# EAGLE design remote (EAGLE 7.2.0)
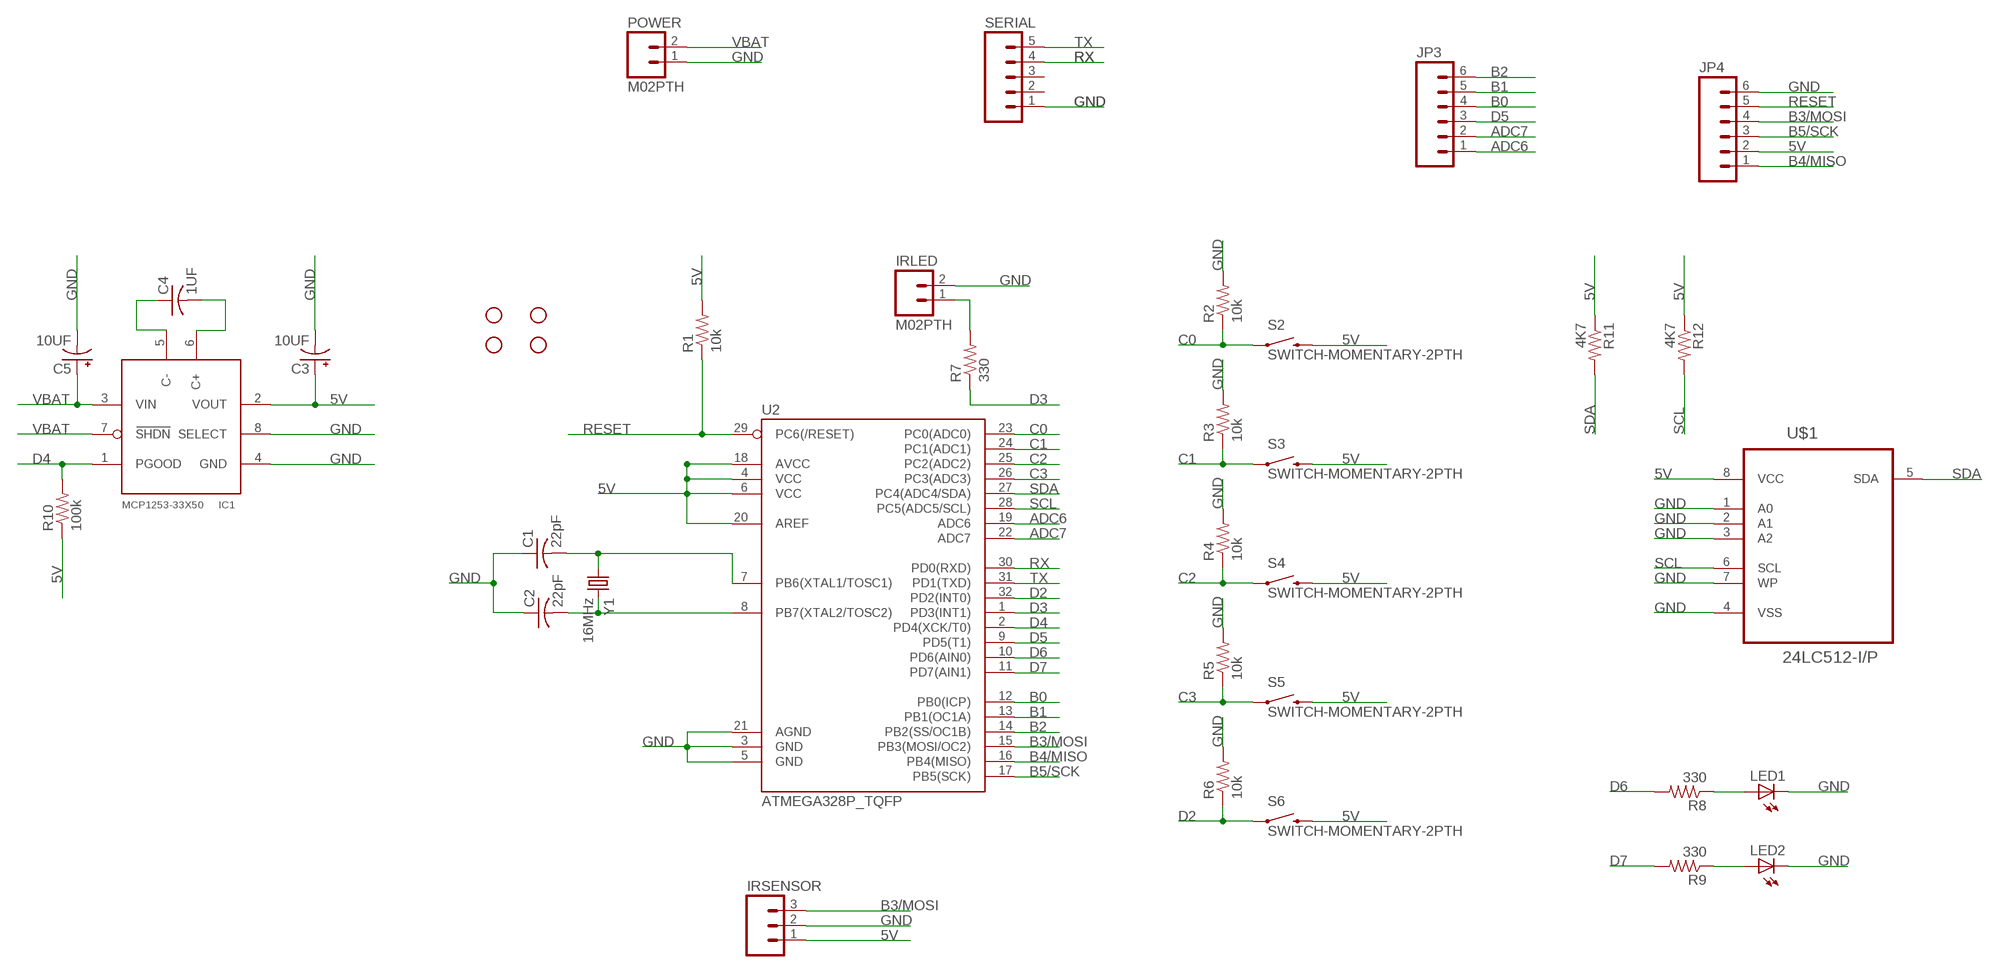
[diagram p0: schematic, sheet 1]

## Parts
C1  22pF  C-USC0805  [C0805]
C2  22pF  C-USC0805  [C0805]
C3  10UF  CPOL-USA/3216-18W  [A/3216-18W]
C4  1UF  C-USC0805  [C0805]
C5  10UF  CPOL-USA/3216-18W  [A/3216-18W]
IC1  MCP1253-33X50  [MSOP8]
IRLED  M02PTH  [1X02]
IRSENSOR  M03PTH  [1X03]
JP1  STAND-OFF  [STAND-OFF]
JP2  STAND-OFF  [STAND-OFF]
JP3  M06SIP  [1X06]
JP4  M06SIP  [1X06]
JP6  STAND-OFF  [STAND-OFF]
JP7  STAND-OFF  [STAND-OFF]
LED1  LEDCHIPLED_0805  [CHIPLED_0805]
LED2  LEDCHIPLED_0805  [CHIPLED_0805]
POWER  M02PTH  [1X02]
R1  10k  R-US_R0805  [R0805]
R2  10k  R-US_R0805  [R0805]
R3  10k  R-US_R0805  [R0805]
R4  10k  R-US_R0805  [R0805]
R5  10k  R-US_R0805  [R0805]
R6  10k  R-US_R0805  [R0805]
R7  330  R-US_R0805  [R0805]
R8  330  R-US_R0805  [R0805]
R9  330  R-US_R0805  [R0805]
R10  100k  R-US_R0805  [R0805]
R11  4K7  R-US_R0805  [R0805]
R12  4K7  R-US_R0805  [R0805]
S2  SWITCH-MOMENTARY-2PTH  [TACTILE-PTH]
S3  SWITCH-MOMENTARY-2PTH  [TACTILE-PTH]
S4  SWITCH-MOMENTARY-2PTH  [TACTILE-PTH]
S5  SWITCH-MOMENTARY-2PTH  [TACTILE-PTH]
S6  SWITCH-MOMENTARY-2PTH  [TACTILE-PTH]
SERIAL  M05PTH  [1X05]
U2  ATMEGA328P_TQFP  [TQFP32-08]
U$1  24LC512-I/P  [DIP254P762X432-8]
Y1  16MHz  CRYSTALHC49US  [HC49US]

## Nets
5V: C3.+ IC1.2(VOUT) IRSENSOR.1 JP4.2 R1.2 R10.1 R11.1 R12.1 S2.3 S3.3 S4.3 S5.3 S6.3 U2.4(VCC) U2.6(VCC) U2.18(AVCC) U2.20(AREF) U$1.8(VCC)
ADC6: JP3.1 U2.19(ADC6)
ADC7: JP3.2 U2.22(ADC7)
B0: JP3.4 U2.12(PB0(ICP))
B1: JP3.5 U2.13(PB1(OC1A))
B2: JP3.6 U2.14(PB2(SS/OC1B))
B3/MOSI: IRSENSOR.3 JP4.4 U2.15(PB3(MOSI/OC2))
B4/MISO: JP4.1 U2.16(PB4(MISO))
B5/SCK: JP4.3 U2.17(PB5(SCK))
C0: R2.1 S2.1 U2.23(PC0(ADC0))
C1: R3.1 S3.1 U2.24(PC1(ADC1))
C2: R4.1 S4.1 U2.25(PC2(ADC2))
C3: R5.1 S5.1 U2.26(PC3(ADC3))
D2: R6.1 S6.1 U2.32(PD2(INT0))
D3: R7.1 U2.1(PD3(INT1))
D4: IC1.1(PGOOD) R10.2 U2.2(PD4(XCK/T0))
D5: JP3.3 U2.9(PD5(T1))
D6: R8.2 U2.10(PD6(AIN0))
D7: R9.2 U2.11(PD7(AIN1))
GND: C1.1 C2.1 C3.- C5.- IC1.4(GND) IC1.8(SELECT) IRLED.2 IRSENSOR.2 JP4.6 LED1.C LED2.C POWER.1 R2.2 R3.2 R4.2 R5.2 R6.2 SERIAL.1 U2.3(GND) U2.5(GND) U2.21(AGND) U$1.1(A0) U$1.2(A1) U$1.3(A2) U$1.4(VSS) U$1.7(WP)
N$2: C1.2 U2.7(PB6(XTAL1/TOSC1)) Y1.1
N$3: C2.2 U2.8(PB7(XTAL2/TOSC2)) Y1.2
N$4: IRLED.1 R7.2
N$5: LED1.A R8.1
N$6: LED2.A R9.1
N$7: C4.1 IC1.5(C-)
N$8: C4.2 IC1.6(C+)
RESET: JP4.5 R1.1 U2.29(PC6(/RESET))
RX: SERIAL.4 U2.30(PD0(RXD))
SCL: R12.2 U2.28(PC5(ADC5/SCL)) U$1.6(SCL)
SDA: R11.2 U2.27(PC4(ADC4/SDA)) U$1.5(SDA)
TX: SERIAL.5 U2.31(PD1(TXD))
VBAT: C5.+ IC1.3(VIN) IC1.7(SHDN) POWER.2
Unconnected: SERIAL.2 SERIAL.3

## Library data of the parts
C1 C2 C4 = adafruit:C-US: CAPACITOR, American symbol
C3 C5 = adafruit:CPOL-US: POLARIZED CAPACITOR, American symbol
IC1 = microchip-MCP125x-xxx:MCP1253-33X50: 1Hz 3.3V / 5.0V Selectable Switching Regulator
IRLED POWER = SparkFun-Connectors:M02: Standard 2-pin 0.1" header. Use with - straight break away headers ( PRT-00116) - right angle break away headers (PRT-00553) - swiss pins (PRT-00743) - machine pins (PRT-00117) - female headers (PRT-00115) Molex polarized connector foot print use with: PRT-08233 with associated crimp pins and housings. 2.54_SCREWTERM for use with PRT-10571. 3.5mm Screw Terminal footprints for PRT-08084 5mm Screw Terminal footprints for use with PRT-08433
IRSENSOR = SparkFun-Connectors:M03: Header 3 Standard 3-pin 0.1" header. Use with straight break away headers (SKU : PRT-00116), right angle break away headers (PRT-00553), swiss pins (PRT-00743), machine pins (PRT-00117), and female headers (PRT-00115). Molex polarized connector foot print use with SKU : PRT-08232 with associated crimp pins and housings.
JP1 JP2 JP6 JP7 = SparkFun-Electromechanical:STAND-OFF: #4 Stand Off This is the mechanical footprint for a #4 phillips button head screw. Use the keepout ring to avoid running the screw head into surrounding components. SKU : PRT-00447
JP3 JP4 = SparkFun-Connectors:M06: Header 6 Standard 6-pin 0.1" header. Use with straight break away headers (SKU : PRT-00116), right angle break away headers (PRT-00553), swiss pins (PRT-00743), machine pins (PRT-00117), and female headers (PRT-00115). Molex polarized connector foot print use with SKU : PRT-08094 with associated crimp pins and housings. NOTES ON THE VARIANTS LOCK and LOCK_LONGPADS... This footprint was designed to help hold the alignment of a through-hole component (i.e. 6-pin header) while soldering it into place. You may notice that each hole has been shifted either up or down by 0.005 of an inch from it's more standard position (which is a perfectly straight line). This slight alteration caused the pins (the squares in the middle) to touch the edges of the holes. Because they are alternating, it causes a "brace" to hold the component in place. 0.005 has proven to be the perfect amount of "off-center" position when using our standard breakaway headers. Although looks a little odd when you look at the bare footprint, once you have a header in there, the alteration is very hard to notice. Also,if you push a header all the way into place, it is covered up entirely on the bottom side. This idea of altering the position of holes to aid alignment will be further integrated into the Sparkfun Library for other footprints. It can help hold any component with 3 or more connection pins.
LED1 LED2 = adafruit:LED: LED OSRAM: - CHIPLED LG R971, LG N971, LY N971, LG Q971, LY Q971, LO R971, LY R971 LH N974, LH R974 LS Q976, LO Q976, LY Q976 LO Q996 - Hyper CHIPLED LW Q18S LB Q993, LB Q99A, LB R99A - SideLED LS A670, LO A670, LY A670, LG A670, LP A670 LB A673, LV A673, LT A673, LW A673 LH A674 LY A675 LS A676, LA A676, LO A676, LY A676, LW A676 LS A679, LY A679, LG A679 - Hyper Micro SIDELED® LS Y876, LA Y876, LO Y876, LY Y876 LT Y87S - SmartLED LW L88C, LW L88S LB L89C, LB L89S, LG L890 LS L89K, LO L89K, LY L89K LS L896, LA L896, LO L896, LY L896 - TOPLED LS T670, LO T670, LY T670, LG T670, LP T670 LSG T670, LSP T670, LSY T670, LOP T670, LYG T670 LG T671, LOG T671, LSG T671 LB T673, LV T673, LT T673, LW T673 LH T674 LS T676, LA T676, LO T676, LY T676, LB T676, LH T676, LSB T676, LW T676 LB T67C, LV T67C, LT T67C, LS T67K, LO T67K, LY T67K, LW E67C LS E67B, LA E67B, LO E67B, LY E67B, LB E67C, LV E67C, LT E67C LW T67C LS T679, LY T679, LG T679 LS T770, LO T770, LY T770, LG T770, LP T770 LB T773, LV T773, LT T773, LW T773 LH T774 LS E675, LA E675, LY E675, LS T675 LS T776, LA T776, LO T776, LY T776, LB T776 LHGB T686 LT T68C, LB T68C - Hyper Mini TOPLED® LB M676 - Mini TOPLED Santana® LG M470 LS M47K, LO M47K, LY M47K Source: http://www.osram.convergy.de/
R1-R12 = adafruit:R-US_: RESISTOR, American symbol
S2-S6 = SparkFun-Electromechanical:SWITCH-MOMENTARY-2: Various NO switches- pushbuttons, reed, etc
SERIAL = SparkFun-Connectors:M05: Header 5 Standard 5-pin 0.1" header. Use with straight break away headers (SKU : PRT-00116), right angle break away headers (PRT-00553), swiss pins (PRT-00743), machine pins (PRT-00117), and female headers (PRT-00115). Molex polarized connector foot print use with SKU : PRT-08230 with associated crimp pins and housings.
U2 = SparkFun-DigitalIC:ATMEGA328P_TQFP; PROD_ID: IC-09069
U$1 = element14:24LC512-I/P: 512K I2C CMOS Serial EEPROM; MPN: 24LC512-I/P; OC_FARNELL: 9758020; OC_NEWARK: 62K0581; PACKAGE: DIP-8; SUPPLIER: MICROCHIP
Y1 = SparkFun-FreqCtrl:CRYSTAL: Various standard crystals. Proven footprints. Spark Fun Electronics SKU : COM-00534

## Board
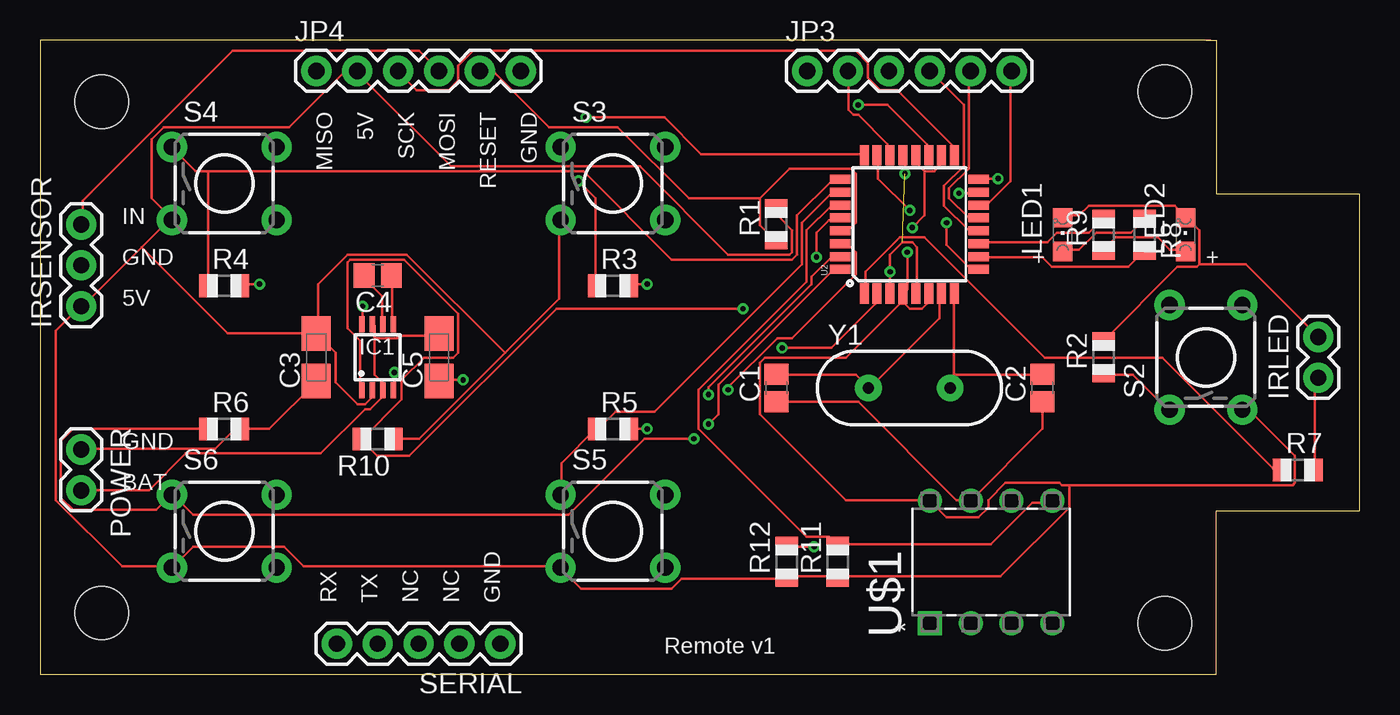
[diagram p1: board, top side]
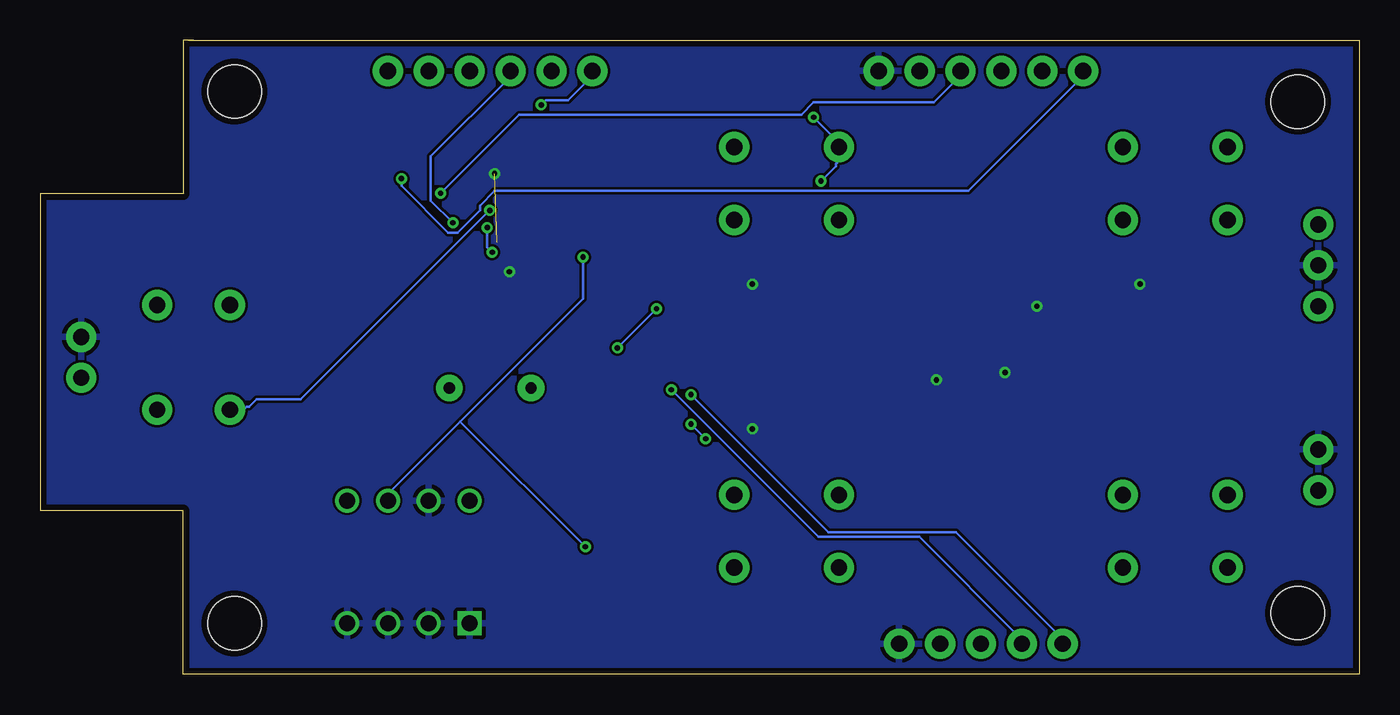
[diagram p2: board, bottom side, seen from below]

Size 81.91 x 39.37 mm. Coordinates in mm from the lower left corner, seen from the top.
Outline: 72.69,39.36 0,39.36 0,0 73.02,0 73.02,10.16 81.91,10.16 81.91,29.84 73.02,29.84 73.02,39.37 72.39,39.37
Copper layers (1*16): Top 0.0356mm / dielectric 1.5011mm / Bottom 0.0356mm
Design rules "LaenPCBOrder": minimum track width 6mil, minimum drill 13mil, track to track 6mil, track to pad 6mil, pad to pad 6mil, via to via 6mil, smd to smd 6mil, copper to edge 15mil, drill to drill 6mil, minimum pad ring 7mil, minimum via ring 7mil, stop-mask expansion 3mil, vias tented up to drill 0mil, thermal gap 10mil

### Footprints (pad centres in the part's own frame; a part is rotated, then mirrored left to right if it is on the bottom)
C0805 = smd 1.3 x 1.5: 1 -0.85,0; 2 0.85,0
A/3216-18W = smd 2.15 x 1.8: + 1.475,0; - -1.475,0
MSOP8 = smd 0.35 x 1: 1 -0.975,-2.05; 2 -0.325,-2.05; 3 0.325,-2.05; 4 0.975,-2.05; 5 0.975,2.05; 6 0.325,2.05; 7 -0.325,2.05; 8 -0.975,2.05
1X02 = drill 1.016 pad 1.88: 1 0,0; 2 2.54,0
1X03 = drill 1.016 pad 1.88: 1 0,0; 2 2.54,0; 3 5.08,0
STAND-OFF = hole 3.302: 0,0
1X06 = drill 1.016 pad 1.88: 1 0,0; 2 2.54,0; 3 5.08,0; 4 7.62,0; 5 10.16,0; 6 12.7,0
CHIPLED_0805 = smd 1.2 x 1.2: A 0,-1.05; C 0,1.05
R0805 = smd 1.1 x 1.4: 1 -1,0; 2 1,0
TACTILE-PTH = drill 1.016 pad 1.88: 1 -3.251,2.261; 2 3.251,2.261; 3 -3.251,-2.261; 4 3.251,-2.261
1X05 = drill 1.016 pad 1.88: 1 0,0; 2 2.54,0; 3 5.08,0; 4 7.62,0; 5 10.16,0
TQFP32-08 = smd 1.27 x 0.559: 1 -4.293,2.8; 2 -4.293,2; 3 -4.293,1.2; 4 -4.293,0.4; 5 -4.293,-0.4; 6 -4.293,-1.2; 7 -4.293,-2; 8 -4.293,-2.8; 17 4.293,-2.8; 18 4.293,-2; 19 4.293,-1.2; 20 4.293,-0.4; 21 4.293,0.4; 22 4.293,1.2; 23 4.293,2; 24 4.293,2.8 | smd 0.559 x 1.27: 9 -2.8,-4.293; 10 -2,-4.293; 11 -1.2,-4.293; 12 -0.4,-4.293; 13 0.4,-4.293; 14 1.2,-4.293; 15 2,-4.293; 16 2.8,-4.293; 25 2.8,4.293; 26 2,4.293; 27 1.2,4.293; 28 0.4,4.293; 29 -0.4,4.293; 30 -1.2,4.293; 31 -2,4.293; 32 -2.8,4.293
DIP254P762X432-8 = drill 0.991 square: 1 -7.62,7.62 | drill 0.991: 2 -7.62,5.08; 3 -7.62,2.54; 4 -7.62,0; 5 0,0; 6 0,2.54; 7 0,5.08; 8 0,7.62
HC49US = drill 0.7 pad 1.651: 1 -2.54,0; 2 2.54,0

### Placement (x,y rotation side)
C1  45.72,17.78 90 top
C2  62.23,17.78 90 top
C3  17.14,19.68 90 top
C4  20.96,24.77 180 top
C5  24.77,19.68 90 top
IC1  20.96,19.68 0 top
IRLED  79.38,18.41 90 top
IRSENSOR  2.54,22.86 90 top
JP1  69.85,3.17 0 top
JP2  69.85,36.2 0 top
JP3  47.62,37.47 0 top
JP4  17.14,37.47 0 top
JP6  3.81,35.56 0 top
JP7  3.81,3.81 0 top
LED1  63.5,27.3 0 top
LED2  71.12,27.3 0 top
POWER  2.54,13.97 270 top
R1  45.72,27.94 90 top
R2  66.04,19.68 90 top
R3  35.56,24.13 0 top
R4  11.43,24.13 0 top
R5  35.56,15.24 0 top
R6  11.43,15.24 0 top
R7  78.1,12.7 0 top
R8  68.58,27.3 270 top
R9  66.04,27.3 90 top
R10  20.96,14.61 180 top
R11  49.53,6.99 90 top
R12  46.36,6.99 90 top
S2  72.39,19.68 90 top
S3  35.56,30.48 0 top
S4  11.43,30.48 0 top
S5  35.56,8.89 0 top
S6  11.43,8.89 0 top
SERIAL  28.57,1.91 180 top
U2  53.98,27.94 90 top
U$1  62.87,10.79 90 top
Y1  53.98,17.78 0 top

### Tracks (layer width: path | path; a pad name or v marks a point on that pad's centre or on a via)
5V  (via drill 0.33)
  Top 0.152: 54.91,31.24 54.46,31.7 54.46,32.16 U2.20 | 54.91,31.24 55.52,31.24 55.83,31.55 55.83,32.16 U2.18 | 53.7,23.01 53.7,23.62 U2.4 53.7,23.77 53.85,23.93 v53.85,26.21 | 53.7,23.01 54,22.71 54.76,22.71 55.07,23.01 55.07,23.62 U2.6 | 53.7,23.01 53.39,23.01 50.04,19.66 45.01,19.66 44.7,19.36 44.7,16.15 50.04,10.82 55.22,10.82 U$1.8 56.29,9.75 58.27,9.75 58.88,10.36 58.88,10.82 59.94,11.89 63.3,11.89 63.45,11.73 63.91,11.73 | 54.91,31.24 54.91,28.5 v54.15,27.74 | 63.91,11.73 77.77,11.73 77.93,11.89 77.93,13.56 75.18,16.31 74.73,16.31 S2.3 | 63.91,11.73 63.91,10.36 59.64,6.1 49.58,6.1 R11.1 49.43,6.1 46.38,6.1 R12.1 46.23,5.94 39.83,5.94 39.22,5.33 33.58,5.33 32.36,6.55 S5.3 32.21,6.71 16.36,6.71 15.14,7.92 9.5,7.92 8.28,6.71 S6.3 8.13,6.71 5.08,6.71 0.96,10.82 0.96,21.34 2.49,22.86 IRSENSOR.1 2.64,22.86 6.3,26.52 | R1.2 45.77,28.8 45.77,28.5 46.69,27.58 46.69,26.21 46.53,26.06 42.72,26.06 37.24,31.55 25.5,31.55 19.71,37.34 JP4.2 19.56,37.34 18.8,37.34 15.44,33.98 7.67,33.98 6.91,33.22 6.91,29.57 8.13,28.35 | 28.85,19.96 32.21,23.32 32.21,28.19 S3.3 | 28.85,19.96 23.52,14.63 22,14.63 R10.1 | IC1.2 20.62,17.53 20.62,17.22 20.17,16.76 19.71,16.76 18.34,18.14 18.34,19.96 17.27,21.03 C3.+ | 8.13,28.35 6.3,26.52 | 6.3,26.52 11.63,21.18 17.12,21.18 C3.+ | 28.85,19.96 22.76,26.06 19.1,26.06 17.27,24.23 17.27,21.18 C3.+ | 8.13,28.35 S4.3
  Bottom 0.152: v54.15,27.74 54.15,26.52 v53.85,26.21
ADC6  (via drill 0.33)
  Top 0.152: v50.8,35.36 52.63,35.36 55.07,32.92 55.07,32.31 U2.19
  Bottom 0.152: v50.8,35.36 50.49,35.66 49.12,35.66 47.75,37.03 47.75,37.34 JP3.1
ADC7
  Top 0.152: U2.22 52.63,32.31 52.63,32.92 50.8,34.75 50.49,34.75 50.19,35.05 50.19,37.34 JP3.2
B0
  Top 0.152: JP3.4 57.35,35.36 57.35,31.55 56.13,30.33 56.13,29.11 57.66,27.58 58.27,27.58 U2.12
B1
  Top 0.152: U2.13 57.66,28.35 56.44,29.57 56.44,30.18 57.66,31.39 57.66,37.34 JP3.5
B2
  Top 0.152: U2.14 58.27,29.26 58.88,29.26 60.25,30.63 60.25,37.34 JP3.6
B3/MOSI  (via drill 0.33)
  Top 0.152: v57.05,29.87 58.27,29.87 U2.15 | JP4.4 23.52,38.71 11.94,38.71 2.64,29.41 2.64,28.04 IRSENSOR.3
  Bottom 0.152: v57.05,29.87 52.17,34.75 34.65,34.75 33.88,35.51 26.42,35.51 24.89,37.03 24.89,37.34 JP4.4
B4/MISO  (via drill 0.33)
  Top 0.152: v59.49,30.79 58.27,30.79 U2.16
  Bottom 0.152: v59.49,30.79 59.49,30.33 56.59,27.43 55.98,27.43 54.61,28.8 54.61,29.11 53.7,30.02 24.28,30.02 17.27,37.03 17.27,37.34 JP4.1
B5/SCK
  Top 0.152: U2.17 56.74,32.31 56.74,32.77 53.24,36.27 52.17,36.27 51.41,37.03 51.41,37.95 50.65,38.71 26.87,38.71 25.96,37.8 25.96,36.88 25.35,36.27 23.37,36.27 22.3,37.34 JP4.3
C0  (via drill 0.33)
  Top 0.152: v54,28.8 52.02,30.79 52.02,32.16 U2.23 | R2.1 66.04,18.59 67.87,18.59 70,16.46 S2.1
  Bottom 0.152: v54,28.8 65.73,17.07 68.48,17.07 68.94,16.61 69.09,16.61 69.24,16.46 70,16.46 S2.1
C1  (via drill 0.33)
  Top 0.152: v33.88,34.59 38.76,34.59 41.05,32.31 51.11,32.31 U2.24 | v33.43,30.63 34.49,29.57 34.49,24.23 R3.1
  Bottom 0.152: v33.88,34.59 32.36,33.07 32.36,32.77 S3.1 32.36,32.61 32.36,31.85 32.51,31.7 32.51,31.55 v33.43,30.63
C2
  Top 0.152: 10.41,31.24 9.65,31.24 8.28,32.61 S4.1 | 10.41,31.24 33.73,31.24 39.22,25.76 46.69,25.76 46.99,26.06 46.99,28.5 49.12,30.63 49.58,30.63 U2.25 | 10.41,31.24 10.41,24.23 R4.1
C3
  Top 0.152: U2.26 49.58,29.87 49.12,29.87 47.3,28.04 47.3,25.45 38.15,16.31 35.71,16.31 34.65,15.24 R5.1 34.49,15.24 32.36,13.11 32.36,11.28 S5.1
D2  (via drill 0.33)
  Top 0.152: v41.5,15.54 42.11,16.15 42.11,17.98 49.12,24.99 49.58,24.99 U2.32 | v40.59,14.63 37.54,14.63 32.82,9.91 9.5,9.91 8.28,11.12 S6.1 8.13,11.12 7.21,10.21 2.03,10.21 1.27,10.97 1.27,14.48 2.03,15.24 R6.1
  Bottom 0.152: v40.59,14.63 v41.5,15.54
D3
  Top 0.152: U2.1 51.26,23.77 51.26,24.99 53.39,27.13 54.91,27.13 62.38,19.66 69.7,19.66 76.56,12.8 77.01,12.8 R7.1
D4  (via drill 0.33)
  Top 0.152: IC1.1 19.86,17.68 19.86,20.73 19.1,21.49 19.1,25.6 19.25,25.76 22.61,25.76 25.96,22.4 25.96,19.96 25.65,19.66 23.82,19.66 22.45,18.29 22.45,17.07 20.02,14.63 R10.2 20.02,14.48 20.93,13.56 22.91,13.56 32.05,22.71 v43.64,22.71 | v46.08,20.27 49.12,20.27 51.87,23.01 51.87,23.62 U2.2
  Bottom 0.152: v43.64,22.71 v46.08,20.27
D5  (via drill 0.33)
  Top 0.152: v56.29,28.04 56.29,26.67 57.81,25.15 U2.9
  Bottom 0.152: v56.29,28.04 57.66,29.41 57.66,32.16 52.78,37.03 52.78,37.34 JP3.3
D6
  Top 0.152: U2.10 58.27,25.91 62.23,25.91 62.84,25.3 67.56,25.3 68.48,26.21 R8.2
D7
  Top 0.152: U2.11 58.27,26.82 62.54,26.82 63.14,27.43 65.13,27.43 66.04,28.35 R9.2
GND  (via drill 0.33)  (1 unrouted)
  Top 0.152: LED1.C 63.6,28.5 64.52,28.5 65.13,29.11 70.46,29.11 71.07,28.5 LED2.C 71.22,28.35 71.98,27.58 71.98,25.45 | 71.98,25.45 71.83,25.3 70.61,25.3 66.04,20.73 R2.2 | C3.- 17.12,18.14 14.22,15.24 R6.2 12.09,15.24 10.87,14.02 2.64,14.02 POWER.1 | U2.3 52.78,23.77 v52.78,24.99 52.78,26.06 53.54,26.82 54.15,26.82 54.46,26.52 54.46,23.77 U2.5 | v22,18.75 22,17.68 IC1.4 | v20.02,22.86 20.02,21.79 IC1.8 | v53.7,31.09 53.7,32.16 U2.21 | v13.61,24.23 12.55,24.23 R4.2 | v37.69,15.24 R5.2 | v37.69,24.23 36.63,24.23 R3.2 | C1.1 45.77,16.92 50.8,16.92 56.9,10.82 57.66,10.82 U$1.7 62.23,15.24 C2.1 | v26.26,18.29 24.89,18.29 C5.- | 71.98,25.45 74.88,25.45 IRLED.2
  pour Bottom: 0,39.37 73.02,39.37 73.02,29.84 81.91,29.84 81.91,10.16 73.02,10.16 73.02,0 0,0
N$2
  Top 0.152: U2.7 55.83,23.62 55.83,22.1 51.56,17.83 Y1.1 51.41,17.83 50.65,18.59 45.77,18.59 C1.2
N$3
  Top 0.152: 56.74,18.59 56.74,17.98 56.59,17.83 Y1.2 56.74,18.59 | 56.74,18.59 56.74,23.62 U2.8 | 56.74,18.59 62.23,18.59 C2.2
N$4
  Top 0.152: R7.2 79.15,12.8 79.15,18.14 79.3,18.29 IRLED.1
N$5
  Top 0.152: LED1.A 63.6,26.36 64.52,26.36 65.58,27.43 67.72,27.43 68.48,28.19 R8.1
N$6
  Top 0.152: LED2.A 71.07,26.36 70.15,26.36 69.39,27.13 66.8,27.13 66.04,26.36 R9.1
N$7
  Top 0.152: IC1.5 21.84,21.79 21.84,24.69 C4.1
N$8
  Top 0.152: IC1.6 21.23,21.79 21.23,23.47 20.02,24.69 C4.2
RESET
  Top 0.152: 44.7,29.57 46.53,31.39 50.34,31.39 50.65,31.09 50.65,28.04 50.19,27.58 49.73,27.58 U2.29 | 44.7,29.57 44.7,27.89 45.62,26.98 R1.1 | 44.7,29.57 40.28,29.57 35.87,33.98 31.6,33.98 28.25,37.34 27.33,37.34 JP4.5
RX  (via drill 0.33)
  Top 0.152: v42.72,17.68 42.72,17.83 45.77,20.88 46.69,20.88 50.65,24.84 50.65,26.21 50.19,26.67 49.73,26.67 U2.30
  Bottom 0.152: v42.72,17.68 33.58,8.53 27.33,8.53 21.08,2.29 21.08,1.98 SERIAL.4
SCL  (via drill 0.33)
  Top 0.152: v48.21,25.91 48.21,27.43 48.97,28.19 49.58,28.19 U2.28 | v48.06,7.92 46.38,7.92 R12.2
  Bottom 0.152: v48.21,25.91 48.21,23.32 55.83,15.7 | 55.83,15.7 60.25,11.28 60.25,10.82 U$1.6 | 55.83,15.7 v48.06,7.92
SDA
  Top 0.152: U2.27 49.58,29.11 49.12,29.11 47.6,27.58 47.6,24.38 40.89,17.68 40.89,15.24 47.6,8.53 48.97,8.53 49.43,8.08 R11.2 49.58,8.08 59.03,8.08 61.62,10.67 62.84,10.67 U$1.5
TX  (via drill 0.33)
  Top 0.152: v41.5,17.37 41.5,17.83 47.9,24.23 47.9,24.69 49.12,25.91 49.58,25.91 U2.31
  Bottom 0.152: v41.5,17.37 32.97,8.84 25.04,8.84 18.49,2.29 18.49,1.98 SERIAL.5
VBAT
  Top 0.152: 20.78,20.88 20.78,18.59 21.23,18.14 21.23,17.68 IC1.3 21.23,17.53 21.23,17.22 20.47,16.46 20.17,16.46 17.42,13.72 9.04,13.72 6.76,11.43 POWER.2 | 20.78,20.88 20.78,21.64 IC1.7 | 20.78,20.88 22.15,20.88 22.3,21.03 24.74,21.03 C5.+

### Text on the board
tPlace: MISO | 5V | SCK | MOSI | RESET | GND | IN | GND | + | + | 5V | GND | BAT | RX | TX | NC | NC | GND | Remote v1